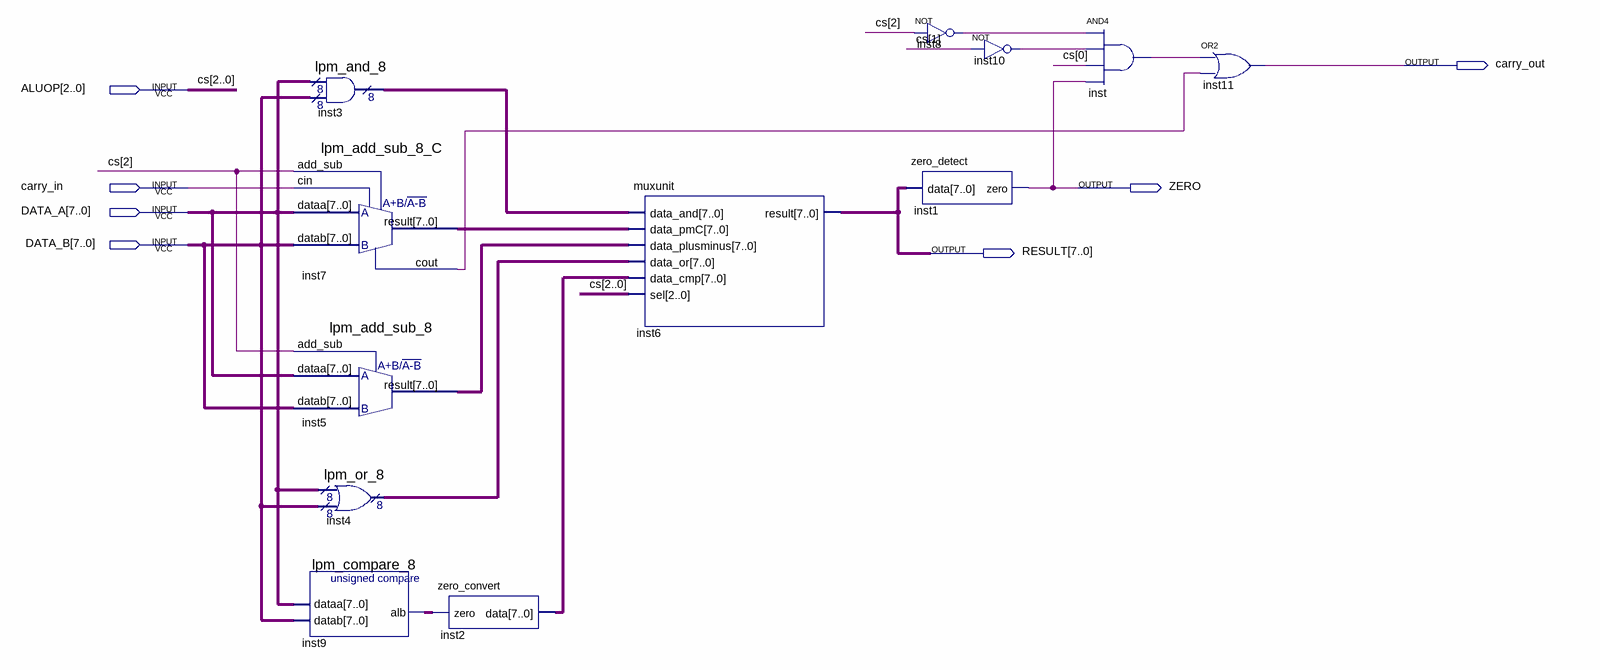
[diagram p0: schematic sheet]
// Quartus schematic alu8.bdf as structural Verilog: 12 symbols, 7 pins
module alu8 (
  input  [2:0] ALUOP,
  input  carry_in,
  input  [7:0] DATA_A,
  input  [7:0] DATA_B,
  output carry_out,
  output ZERO,
  output [7:0] RESULT
);

  wire inst7_cout, inst8_out, inst9_alb, inst10_out, inst_out;
  wire [7:0] inst2_data, inst3_result, inst4_result, inst5_result, inst7_result;

  lpm_add_sub_8_C inst7 (
    .dataa(DATA_A), .datab(DATA_B), .add_sub(ALUOP[2]), .cin(carry_in), .result(inst7_result),
    .cout(inst7_cout));
  lpm_add_sub_8 inst5 (.dataa(DATA_A), .datab(DATA_B), .add_sub(ALUOP[2]), .result(inst5_result));
  lpm_compare_8 inst9 (.dataa(DATA_A), .datab(DATA_B), .alb(inst9_alb));
  lpm_and_8 inst3 (.data0x(DATA_A), .data1x(DATA_B), .result(inst3_result));
  lpm_or_8 inst4 (.data0x(DATA_A), .data1x(DATA_B), .result(inst4_result));
  zero_convert inst2 (.zero(inst9_alb), .data(inst2_data));
  muxunit inst6 (
    .data_and(inst3_result), .data_pmC(inst7_result), .data_plusminus(inst5_result), .data_or(inst4_result),
    .data_cmp(inst2_data), .sel(ALUOP), .result(RESULT));
  not inst8 (inst8_out, ALUOP[2]);
  zero_detect inst1 (.data(RESULT), .zero(ZERO));
  not inst10 (inst10_out, ALUOP[1]);
  and inst (inst_out, inst8_out, inst10_out, ALUOP[0], ZERO);
  or inst11 (carry_out, inst_out, inst7_cout);

  // Other names for the same wires on the sheet: cs[2:0] = ALUOP
endmodule
